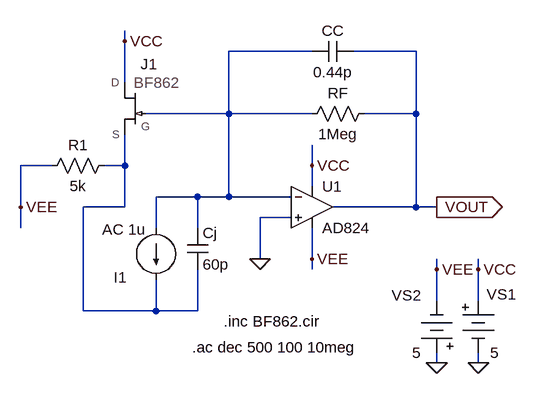
[diagram p0: schematic fig-03-03-20.asc]
fig-03-03-20.asc, the LTspice schematic file:
Version 4
SHEET 1 880 680
WIRE -80 -80 -80 -96
WIRE 208 -64 80 -64
WIRE 368 -64 272 -64
WIRE -80 -16 -80 -80
WIRE 80 32 80 -64
WIRE 80 32 -48 32
WIRE 208 32 80 32
WIRE 368 32 368 -64
WIRE 368 32 288 32
WIRE -192 112 -240 112
WIRE -80 112 -80 64
WIRE -80 112 -112 112
WIRE 208 112 208 80
WIRE 208 144 208 112
WIRE 32 160 -32 160
WIRE 80 160 80 32
WIRE 80 160 32 160
WIRE 176 160 80 160
WIRE -240 176 -240 112
WIRE -80 176 -80 112
WIRE -80 176 -144 176
WIRE 368 176 368 32
WIRE 368 176 240 176
WIRE 400 176 368 176
WIRE 176 192 128 192
WIRE -240 208 -240 176
WIRE -32 208 -32 160
WIRE 32 208 32 160
WIRE 128 256 128 192
WIRE 208 256 208 208
WIRE 208 272 208 256
WIRE 400 272 400 256
WIRE 464 272 464 256
WIRE 400 320 400 272
WIRE 464 320 464 272
WIRE -144 336 -144 176
WIRE -32 336 -32 288
WIRE -32 336 -144 336
WIRE 32 336 32 272
WIRE 32 336 -32 336
WIRE 400 416 400 400
WIRE 464 416 464 400
FLAG 128 256 0
FLAG 400 176 VOUT
IOPIN 400 176 Out
FLAG 400 416 0
FLAG 464 416 0
FLAG 400 272 VEE
FLAG 464 272 VCC
FLAG 208 112 VCC
FLAG 208 256 VEE
FLAG -80 -80 VCC
FLAG -240 176 VEE
SYMBOL res 304 16 R90
WINDOW 0 0 56 VBottom 2
WINDOW 3 32 56 VTop 2
SYMATTR InstName RF
SYMATTR Value 1Meg
SYMBOL Misc\\battery 464 304 R0
WINDOW 0 13 6 Left 2
WINDOW 3 18 96 Left 2
WINDOW 123 0 0 Left 0
WINDOW 39 0 0 Left 0
SYMATTR InstName VS1
SYMATTR Value 5
SYMBOL Misc\\battery 400 416 R180
WINDOW 0 24 104 Left 2
WINDOW 3 24 16 Left 2
WINDOW 123 0 0 Left 0
WINDOW 39 0 0 Left 0
SYMATTR InstName VS2
SYMATTR Value 5
SYMBOL Opamps\\AD824 208 112 R0
SYMATTR InstName U1
SYMBOL cap 16 208 R0
SYMATTR InstName Cj
SYMATTR Value 60p
SYMBOL current -32 208 R0
WINDOW 0 -65 76 Left 2
WINDOW 3 24 0 Left 2
WINDOW 123 -83 2 Left 2
WINDOW 39 0 0 Left 0
SYMATTR InstName I1
SYMATTR Value ""
SYMATTR Value2 AC 1u
SYMBOL cap 272 -80 R90
WINDOW 0 0 32 VBottom 2
WINDOW 3 32 32 VTop 2
SYMATTR InstName CC
SYMATTR Value 0.44p
SYMBOL BF862 -80 16 M0
WINDOW 0 -50 -60 Left 2
SYMATTR InstName J1
SYMBOL res -96 96 R90
WINDOW 0 0 56 VBottom 2
WINDOW 3 32 56 VTop 2
SYMATTR InstName R1
SYMATTR Value 5k
TEXT 24 392 Left 2 !.ac dec 500 100 10meg
TEXT 72 352 Left 2 !.inc BF862.cir

The netlist it stands for:
* fig-03-03-20.asc
RF VOUT N001 1Meg
VS1 VCC 0 5
VS2 0 VEE 5
XU1 0 N001 VCC VEE VOUT AD824  ; pins In+ In- V+ V- OUT
Cj N001 N002 60p
I1 N001 N002 AC 1u
CC VOUT N001 0.44p
XJ1 VCC N001 N002 BF862  ; pins D G S
R1 N002 VEE 5k
.ac dec 500 100 10meg
.inc BF862.cir
.backanno
.end